# Altium schematic sheet 故指测试架LCD屏板.SchDoc
size A4 portrait
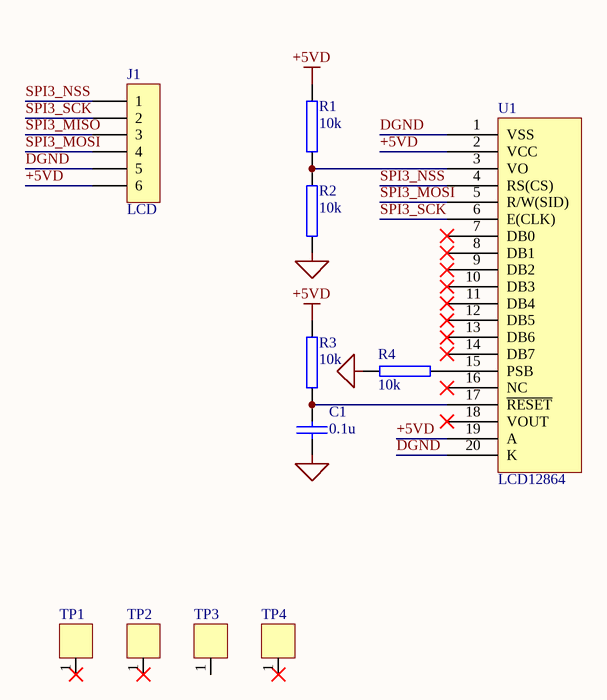
[diagram p0: 故指测试架LCD屏板.SchDoc]

## Parts
C1  0.1u  [0805]
J1  LCD  [2510-6Y]
R1  10k  [0805]
R2  10k  [0805]
R3  10k  [0805]
R4  10k  [0805]
TP1  (no value)  [PAD4.5]
TP2  (no value)  [PAD4.5]
TP3  (no value)  [PAD4.5]
TP4  (no value)  [PAD4.5]
U1  LCD12864  [LCD12864]

## Nets
+5VD: J1.6 R1.1 R3.1 U1.2(VCC) U1.19(A)
DGND: C1.1 J1.5 R2.2 R4.1 U1.1(VSS) U1.20(K)
SPI3_MISO: J1.3
SPI3_MOSI: J1.4 U1.5(R/W(SID))
SPI3_NSS: J1.1 U1.4(RS(CS))
SPI3_SCK: J1.2 U1.6(E(CLK))
NetC1_2: C1.2 R3.2 U1.17(~{RESET})
NetR1_2: R1.2 R2.1 U1.3(VO)
NetR4_2: R4.2 U1.15(PSB)

Not connected (* = marked no-connect by the designer): TP1 1*; TP2 1*; TP3 1; TP4 1*; U1 7(DB0)* 8(DB1)* 9(DB2)* 10(DB3)* 11(DB4)* 12(DB5)* 13(DB6)* 14(DB7)* 16(NC)* 18(VOUT)*

## Notes on the sheet
- Title
- Size:
- Date:
- A4
- Number:
- Time:
- Revision:
- Sheet
- of
- File:

## Library data of the parts
C1 = CAP: Capacitor
J1 = CON6
R1-R4 = R
TP1-TP4 = TESTPT